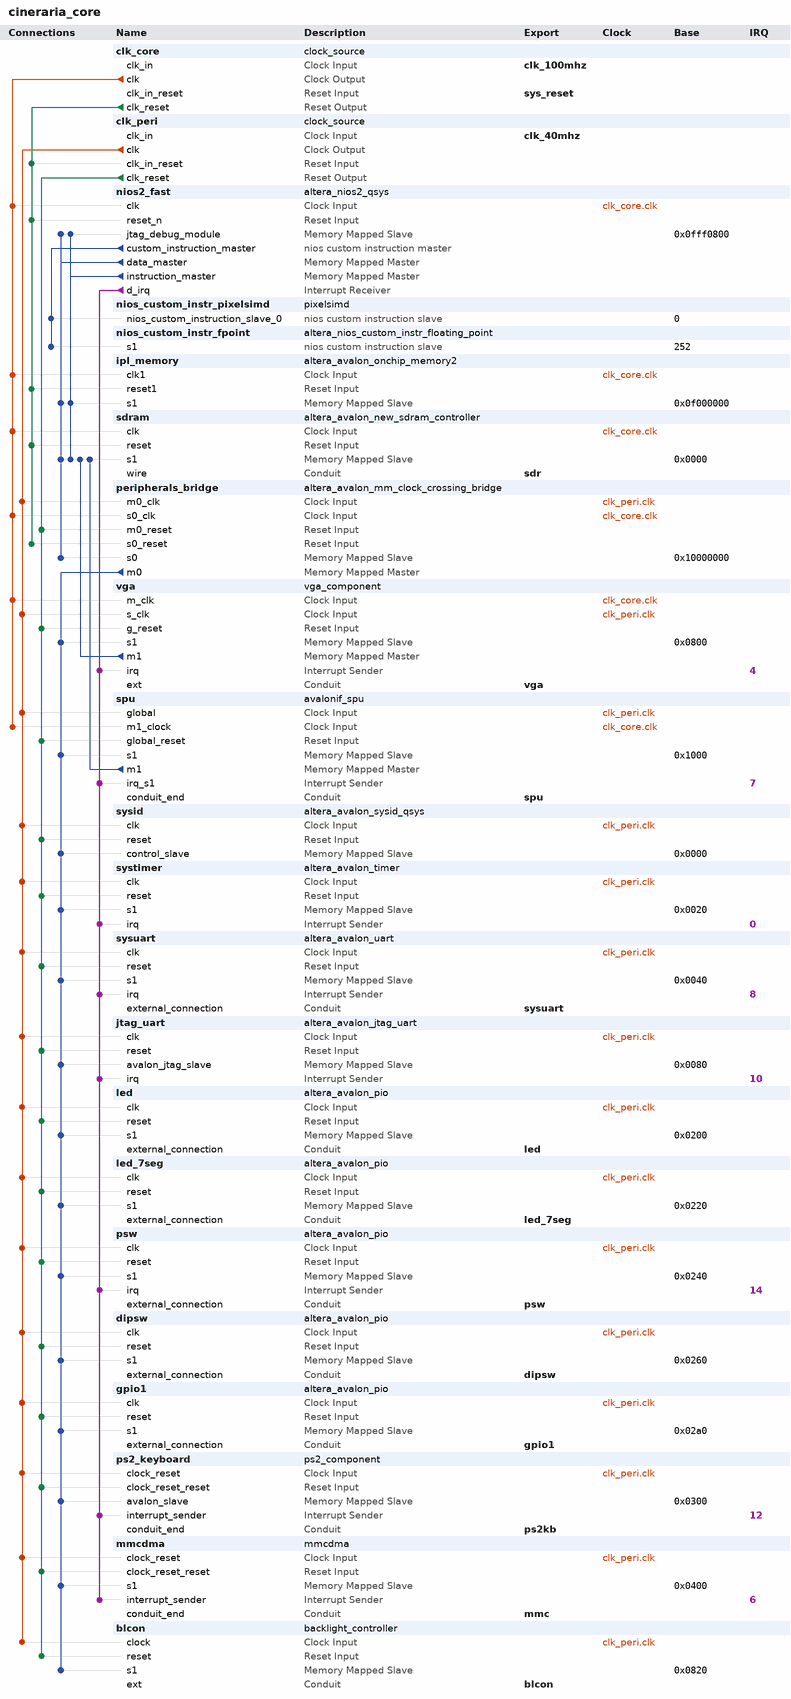
[diagram p0: system contents]
# Platform Designer (Qsys) system cineraria_core, Cyclone III EP3C16F484C6
# Parameters at their usual value, and those the tool derives, are not listed.
package require -exact qsys 13.0.1.99.2
create_system cineraria_core
set_project_property DEVICE_FAMILY {Cyclone III}
set_project_property DEVICE EP3C16F484C6

add_instance clk_core clock_source 13.0
set_instance_parameter_value clk_core clockFrequency 100000000

add_instance clk_peri clock_source 13.0
set_instance_parameter_value clk_peri clockFrequency 40000000

add_instance nios2_fast altera_nios2_qsys 13.0
set_instance_parameter_value nios2_fast muldiv_divider true
set_instance_parameter_value nios2_fast resetSlave ipl_memory.s1
set_instance_parameter_value nios2_fast mmu_TLBMissExcSlave None
set_instance_parameter_value nios2_fast exceptionSlave sdram.s1
set_instance_parameter_value nios2_fast breakSlave nios2_fast.jtag_debug_module
set_instance_parameter_value nios2_fast impl Fast
set_instance_parameter_value nios2_fast icache_size 8192
set_instance_parameter_value nios2_fast icache_burstType Sequential
set_instance_parameter_value nios2_fast dcache_bursts true
set_instance_parameter_value nios2_fast dcache_size 8192

add_instance nios_custom_instr_pixelsimd pixelsimd 1.0

add_instance nios_custom_instr_fpoint altera_nios_custom_instr_floating_point 13.0
set_instance_parameter_value nios_custom_instr_fpoint useDivider 0

add_instance ipl_memory altera_avalon_onchip_memory2 13.0.1.99.2
set_instance_parameter_value ipl_memory dataWidth 32
set_instance_parameter_value ipl_memory dualPort false
set_instance_parameter_value ipl_memory initMemContent true
set_instance_parameter_value ipl_memory initializationFileName ipl_memory_elfboot
set_instance_parameter_value ipl_memory instanceID BROM
set_instance_parameter_value ipl_memory memorySize 8192
set_instance_parameter_value ipl_memory useNonDefaultInitFile true

add_instance sdram altera_avalon_new_sdram_controller 13.0.1.99.2
set_instance_parameter_value sdram TAC 5.4
set_instance_parameter_value sdram TRCD 18.0
set_instance_parameter_value sdram TRFC 60.0
set_instance_parameter_value sdram TRP 18.0
set_instance_parameter_value sdram casLatency 2
set_instance_parameter_value sdram columnWidth 8
set_instance_parameter_value sdram dataWidth 16
set_instance_parameter_value sdram generateSimulationModel false
set_instance_parameter_value sdram model single_Micron_MT48LC4M32B2_7_chip
set_instance_parameter_value sdram numberOfBanks 4
set_instance_parameter_value sdram numberOfChipSelects 1
set_instance_parameter_value sdram powerUpDelay 200.0
set_instance_parameter_value sdram refreshPeriod 15.625
set_instance_parameter_value sdram rowWidth 12

add_instance peripherals_bridge altera_avalon_mm_clock_crossing_bridge 13.0
set_instance_parameter_value peripherals_bridge DATA_WIDTH 32
set_instance_parameter_value peripherals_bridge ADDRESS_WIDTH 14
set_instance_parameter_value peripherals_bridge MAX_BURST_SIZE 1
set_instance_parameter_value peripherals_bridge COMMAND_FIFO_DEPTH 4
set_instance_parameter_value peripherals_bridge RESPONSE_FIFO_DEPTH 4
set_instance_parameter_value peripherals_bridge MASTER_SYNC_DEPTH 2
set_instance_parameter_value peripherals_bridge SLAVE_SYNC_DEPTH 2

add_instance vga vga_component 1.1
set_instance_parameter_value vga LINEOFFSETBYTES 2048
set_instance_parameter_value vga H_TOTAL 525
set_instance_parameter_value vga H_SYNC 40
set_instance_parameter_value vga H_BACKP 0
set_instance_parameter_value vga H_ACTIVE 480
set_instance_parameter_value vga V_TOTAL 288
set_instance_parameter_value vga V_SYNC 3
set_instance_parameter_value vga V_BACKP 0
set_instance_parameter_value vga V_ACTIVE 272

add_instance spu avalonif_spu 1.0

add_instance sysid altera_avalon_sysid_qsys 13.0
set_instance_parameter_value sysid id 538117937

add_instance systimer altera_avalon_timer 13.0.1.99.2
set_instance_parameter_value systimer period 1
set_instance_parameter_value systimer periodUnits MSEC

add_instance sysuart altera_avalon_uart 13.0.1.99.2
set_instance_parameter_value sysuart baud 115200
set_instance_parameter_value sysuart dataBits 8
set_instance_parameter_value sysuart fixedBaud false
set_instance_parameter_value sysuart parity NONE
set_instance_parameter_value sysuart stopBits 1
set_instance_parameter_value sysuart useCtsRts true

add_instance jtag_uart altera_avalon_jtag_uart 13.0.1.99.2
set_instance_parameter_value jtag_uart simInteractiveOptions NO_INTERACTIVE_WINDOWS

add_instance led altera_avalon_pio 13.0.1.99.2
set_instance_parameter_value led direction Output
set_instance_parameter_value led width 10

add_instance led_7seg altera_avalon_pio 13.0.1.99.2
set_instance_parameter_value led_7seg direction Output
set_instance_parameter_value led_7seg width 32

add_instance psw altera_avalon_pio 13.0.1.99.2
set_instance_parameter_value psw captureEdge true
set_instance_parameter_value psw direction Input
set_instance_parameter_value psw edgeType FALLING
set_instance_parameter_value psw generateIRQ true
set_instance_parameter_value psw irqType EDGE
set_instance_parameter_value psw width 3

add_instance dipsw altera_avalon_pio 13.0.1.99.2
set_instance_parameter_value dipsw direction Input
set_instance_parameter_value dipsw width 10

add_instance gpio1 altera_avalon_pio 13.0.1.99.2
set_instance_parameter_value gpio1 direction Bidir
set_instance_parameter_value gpio1 width 32

add_instance ps2_keyboard ps2_component 1.0

add_instance mmcdma mmcdma 1.0
set_instance_parameter_value mmcdma SYSTEMCLOCKINFO 40000000

add_instance blcon backlight_controller 1.0

# connections
add_connection clk_core.clk ipl_memory.clk1 clock
add_connection clk_core.clk nios2_fast.clk clock
add_connection clk_core.clk peripherals_bridge.s0_clk clock
add_connection clk_core.clk sdram.clk clock
add_connection clk_core.clk spu.m1_clock clock
add_connection clk_core.clk vga.m_clk clock
add_connection clk_peri.clk blcon.clock clock
add_connection clk_peri.clk dipsw.clk clock
add_connection clk_peri.clk gpio1.clk clock
add_connection clk_peri.clk jtag_uart.clk clock
add_connection clk_peri.clk led.clk clock
add_connection clk_peri.clk led_7seg.clk clock
add_connection clk_peri.clk mmcdma.clock_reset clock
add_connection clk_peri.clk peripherals_bridge.m0_clk clock
add_connection clk_peri.clk ps2_keyboard.clock_reset clock
add_connection clk_peri.clk psw.clk clock
add_connection clk_peri.clk spu.global clock
add_connection clk_peri.clk sysid.clk clock
add_connection clk_peri.clk systimer.clk clock
add_connection clk_peri.clk sysuart.clk clock
add_connection clk_peri.clk vga.s_clk clock
add_connection clk_core.clk_reset clk_peri.clk_in_reset reset
add_connection clk_core.clk_reset ipl_memory.reset1 reset
add_connection clk_core.clk_reset nios2_fast.reset_n reset
add_connection clk_core.clk_reset peripherals_bridge.s0_reset reset
add_connection clk_core.clk_reset sdram.reset reset
add_connection clk_peri.clk_reset blcon.reset reset
add_connection clk_peri.clk_reset dipsw.reset reset
add_connection clk_peri.clk_reset gpio1.reset reset
add_connection clk_peri.clk_reset jtag_uart.reset reset
add_connection clk_peri.clk_reset led.reset reset
add_connection clk_peri.clk_reset led_7seg.reset reset
add_connection clk_peri.clk_reset mmcdma.clock_reset_reset reset
add_connection clk_peri.clk_reset peripherals_bridge.m0_reset reset
add_connection clk_peri.clk_reset ps2_keyboard.clock_reset_reset reset
add_connection clk_peri.clk_reset psw.reset reset
add_connection clk_peri.clk_reset spu.global_reset reset
add_connection clk_peri.clk_reset sysid.reset reset
add_connection clk_peri.clk_reset systimer.reset reset
add_connection clk_peri.clk_reset sysuart.reset reset
add_connection clk_peri.clk_reset vga.g_reset reset
add_connection nios2_fast.data_master ipl_memory.s1 avalon
set_connection_parameter_value nios2_fast.data_master/ipl_memory.s1 baseAddress 0x0f000000
add_connection nios2_fast.data_master nios2_fast.jtag_debug_module avalon
set_connection_parameter_value nios2_fast.data_master/nios2_fast.jtag_debug_module baseAddress 0x0fff0800
add_connection nios2_fast.data_master peripherals_bridge.s0 avalon
set_connection_parameter_value nios2_fast.data_master/peripherals_bridge.s0 baseAddress 0x10000000
add_connection nios2_fast.data_master sdram.s1 avalon
set_connection_parameter_value nios2_fast.data_master/sdram.s1 baseAddress 0x0000
add_connection nios2_fast.instruction_master ipl_memory.s1 avalon
set_connection_parameter_value nios2_fast.instruction_master/ipl_memory.s1 baseAddress 0x0f000000
add_connection nios2_fast.instruction_master nios2_fast.jtag_debug_module avalon
set_connection_parameter_value nios2_fast.instruction_master/nios2_fast.jtag_debug_module baseAddress 0x0fff0800
add_connection nios2_fast.instruction_master sdram.s1 avalon
set_connection_parameter_value nios2_fast.instruction_master/sdram.s1 baseAddress 0x0000
add_connection peripherals_bridge.m0 blcon.s1 avalon
set_connection_parameter_value peripherals_bridge.m0/blcon.s1 baseAddress 0x0820
add_connection peripherals_bridge.m0 dipsw.s1 avalon
set_connection_parameter_value peripherals_bridge.m0/dipsw.s1 baseAddress 0x0260
add_connection peripherals_bridge.m0 gpio1.s1 avalon
set_connection_parameter_value peripherals_bridge.m0/gpio1.s1 baseAddress 0x02a0
add_connection peripherals_bridge.m0 jtag_uart.avalon_jtag_slave avalon
set_connection_parameter_value peripherals_bridge.m0/jtag_uart.avalon_jtag_slave baseAddress 0x0080
add_connection peripherals_bridge.m0 led.s1 avalon
set_connection_parameter_value peripherals_bridge.m0/led.s1 baseAddress 0x0200
add_connection peripherals_bridge.m0 led_7seg.s1 avalon
set_connection_parameter_value peripherals_bridge.m0/led_7seg.s1 baseAddress 0x0220
add_connection peripherals_bridge.m0 mmcdma.s1 avalon
set_connection_parameter_value peripherals_bridge.m0/mmcdma.s1 baseAddress 0x0400
add_connection peripherals_bridge.m0 ps2_keyboard.avalon_slave avalon
set_connection_parameter_value peripherals_bridge.m0/ps2_keyboard.avalon_slave baseAddress 0x0300
add_connection peripherals_bridge.m0 psw.s1 avalon
set_connection_parameter_value peripherals_bridge.m0/psw.s1 baseAddress 0x0240
add_connection peripherals_bridge.m0 spu.s1 avalon
set_connection_parameter_value peripherals_bridge.m0/spu.s1 baseAddress 0x1000
add_connection peripherals_bridge.m0 sysid.control_slave avalon
set_connection_parameter_value peripherals_bridge.m0/sysid.control_slave baseAddress 0x0000
add_connection peripherals_bridge.m0 systimer.s1 avalon
set_connection_parameter_value peripherals_bridge.m0/systimer.s1 baseAddress 0x0020
add_connection peripherals_bridge.m0 sysuart.s1 avalon
set_connection_parameter_value peripherals_bridge.m0/sysuart.s1 baseAddress 0x0040
add_connection peripherals_bridge.m0 vga.s1 avalon
set_connection_parameter_value peripherals_bridge.m0/vga.s1 baseAddress 0x0800
add_connection spu.m1 sdram.s1 avalon
set_connection_parameter_value spu.m1/sdram.s1 baseAddress 0x0000
add_connection vga.m1 sdram.s1 avalon
set_connection_parameter_value vga.m1/sdram.s1 baseAddress 0x0000
add_connection nios2_fast.d_irq jtag_uart.irq interrupt
set_connection_parameter_value nios2_fast.d_irq/jtag_uart.irq irqNumber 10
add_connection nios2_fast.d_irq mmcdma.interrupt_sender interrupt
set_connection_parameter_value nios2_fast.d_irq/mmcdma.interrupt_sender irqNumber 6
add_connection nios2_fast.d_irq ps2_keyboard.interrupt_sender interrupt
set_connection_parameter_value nios2_fast.d_irq/ps2_keyboard.interrupt_sender irqNumber 12
add_connection nios2_fast.d_irq psw.irq interrupt
set_connection_parameter_value nios2_fast.d_irq/psw.irq irqNumber 14
add_connection nios2_fast.d_irq spu.irq_s1 interrupt
set_connection_parameter_value nios2_fast.d_irq/spu.irq_s1 irqNumber 7
add_connection nios2_fast.d_irq systimer.irq interrupt
set_connection_parameter_value nios2_fast.d_irq/systimer.irq irqNumber 0
add_connection nios2_fast.d_irq sysuart.irq interrupt
set_connection_parameter_value nios2_fast.d_irq/sysuart.irq irqNumber 8
add_connection nios2_fast.d_irq vga.irq interrupt
set_connection_parameter_value nios2_fast.d_irq/vga.irq irqNumber 4
add_connection nios2_fast.custom_instruction_master nios_custom_instr_fpoint.s1 nios_custom_instruction
set_connection_parameter_value nios2_fast.custom_instruction_master/nios_custom_instr_fpoint.s1 CIName fpoint
set_connection_parameter_value nios2_fast.custom_instruction_master/nios_custom_instr_fpoint.s1 baseAddress 252
add_connection nios2_fast.custom_instruction_master nios_custom_instr_pixelsimd.nios_custom_instruction_slave_0 nios_custom_instruction
set_connection_parameter_value nios2_fast.custom_instruction_master/nios_custom_instr_pixelsimd.nios_custom_instruction_slave_0 CIName pixelsimd
set_connection_parameter_value nios2_fast.custom_instruction_master/nios_custom_instr_pixelsimd.nios_custom_instruction_slave_0 baseAddress 0

# exported interfaces
add_interface clk_100mhz clock sink
set_interface_property clk_100mhz EXPORT_OF clk_core.clk_in
add_interface sys_reset reset sink
set_interface_property sys_reset EXPORT_OF clk_core.clk_in_reset
add_interface clk_40mhz clock sink
set_interface_property clk_40mhz EXPORT_OF clk_peri.clk_in
add_interface sysuart conduit end
set_interface_property sysuart EXPORT_OF sysuart.external_connection
add_interface sdr conduit end
set_interface_property sdr EXPORT_OF sdram.wire
add_interface led conduit end
set_interface_property led EXPORT_OF led.external_connection
add_interface led_7seg conduit end
set_interface_property led_7seg EXPORT_OF led_7seg.external_connection
add_interface psw conduit end
set_interface_property psw EXPORT_OF psw.external_connection
add_interface dipsw conduit end
set_interface_property dipsw EXPORT_OF dipsw.external_connection
add_interface spu conduit end
set_interface_property spu EXPORT_OF spu.conduit_end
add_interface mmc conduit end
set_interface_property mmc EXPORT_OF mmcdma.conduit_end
add_interface ps2kb conduit end
set_interface_property ps2kb EXPORT_OF ps2_keyboard.conduit_end
add_interface gpio1 conduit end
set_interface_property gpio1 EXPORT_OF gpio1.external_connection
add_interface vga conduit end
set_interface_property vga EXPORT_OF vga.ext
add_interface blcon conduit end
set_interface_property blcon EXPORT_OF blcon.ext

set_interconnect_requirement {$system} qsys_mm.clockCrossingAdapter HANDSHAKE
set_interconnect_requirement {$system} qsys_mm.maxAdditionalLatency 1

save_system cineraria_core.qsys
